# Altium schematic sheet RMII.SchDoc
size A4
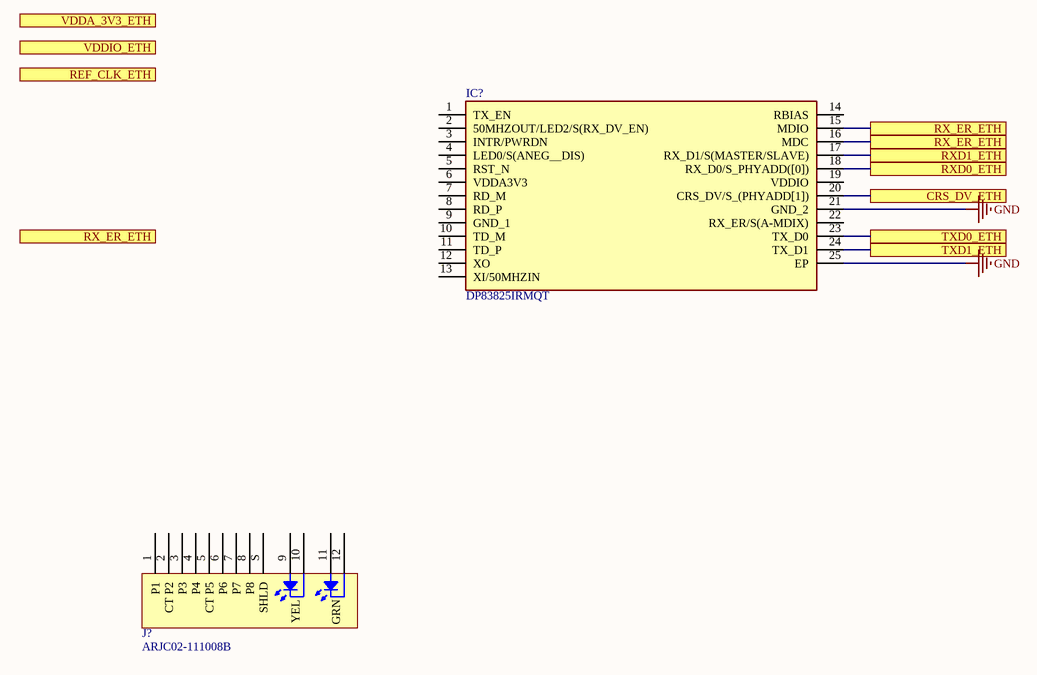
[diagram p0: RMII.SchDoc]

## Parts
IC?  DP83825IRMQT  [DP83825IRMQT]
J?  ARJC02-111008B  [ABRACON ARJC02-111008B]

## Ports
CRS_DV_ETH, REF_CLK_ETH, RX_ER_ETH, RXD0_ETH, RXD1_ETH, TXD0_ETH, TXD1_ETH, VDDA_3V3_ETH, VDDIO_ETH

## Nets
GND: IC?.21(GND_2) IC?.25(EP)
CRS_DV_ETH: IC?.20(CRS_DV/S_(PHYADD[1])) ; port CRS_DV_ETH
RX_ER_ETH: IC?.15(MDIO) IC?.16(MDC) ; port RX_ER_ETH
RXD0_ETH: IC?.18(RX_D0/S_PHYADD([0])) ; port RXD0_ETH
RXD1_ETH: IC?.17(RX_D1/S(MASTER/SLAVE)) ; port RXD1_ETH
TXD0_ETH: IC?.23(TX_D0) ; port TXD0_ETH
TXD1_ETH: IC?.24(TX_D1) ; port TXD1_ETH

Not connected (* = marked no-connect by the designer): IC? 1(TX_EN) 2(50MHZOUT/LED2/S(RX_DV_EN)) 3(INTR/PWRDN) 4(LED0/S(ANEG__DIS)) 5(RST_N) 6(VDDA3V3) 7(RD_M) 8(RD_P) 9(GND_1) 10(TD_M) 11(TD_P) 12(XO) 13(XI/50MHZIN) 14(RBIAS) 19(VDDIO) 22(RX_ER/S(A-MDIX)); J? 1(P1) 2(CT_P2) 3(P3) 4(P4) 5(CT_P5) 6(P6) 7(P7) 8(P8) 9(P9) 10(P10) 11(P11) 12(P12) S(SHLD)

## Notes on the sheet
- Title
- Size:
- Date:
- A4
- Number:
- Time:
- Revision:
- Sheet
- of
- File:
- (in symbol ARJC02-111008B) YEL; GRN

## Library data of the parts
IC? = DP83825IRMQT: Integrated Circuit; Manufacturer_Name: Texas Instruments; Datasheet Link: https://www.ti.com/lit/gpn/dp83825i?HQS=ti-null-null-sf-df-pf-sep-wwe&DCM=yes; Height: 0.8mm; Manufacturer_Part_Number: DP83825IRMQT; Mouser Part Number: 595-DP83825IRMQT; Mouser Price/Stock: https://www.mouser.co.uk/ProductDetail/Texas-Instruments/DP83825IRMQT/?qs=B6kkDfuK7%2FBiCk9ZFiDEMg%3D%3D; Arrow Part Number: DP83825IRMQT; Arrow Price/Stock: https://www.arrow.com/en/products/dp83825irmqt/texas-instruments
J? = ARJC02-111008B: CONN MAGJACK 1PORT 100 BASE-TX; Manufacturer: Abracon LLC; Connector Type: RJ45; LED Color: Yellow - Green; Number of Cores per Jack: 4; Number of Ports: 1; Shielding: Shielded, EMI Finger; Tab Direction: Down; Part Number: ARJC02-111008B; Applications: 10/100 Base-TX, AutoMDIX; ComponentLink1Description: Datasheet; ComponentLink1URL: https://abracon.com/Magnetics/lan/ARJC02-111008B.PDF; ComponentLink2Description: DigiKey Link; ComponentLink2URL: http://digikey.com/product-detail/en/abracon-llc/ARJC02-111008B/535-12605-ND/4696789; Features: Board Guide; Height Above Board: 0.534" (13.55mm); LastUpdated: 15/1/2020 3:56:28; Lifecycle Status: Active; Minimum Order: 1; Mounting Type: Through Hole; Number of Rows: 1; Operating Temperature: 0°C ~ 70°C; Orientation: 90° Angle (Right); Packaging: Tray; Part Status: Active; Price: 7.80; Series: ARJC02; Supplier 1: DigiKey; Supplier Part Number 1: 535-12605-ND; Termination: Solder